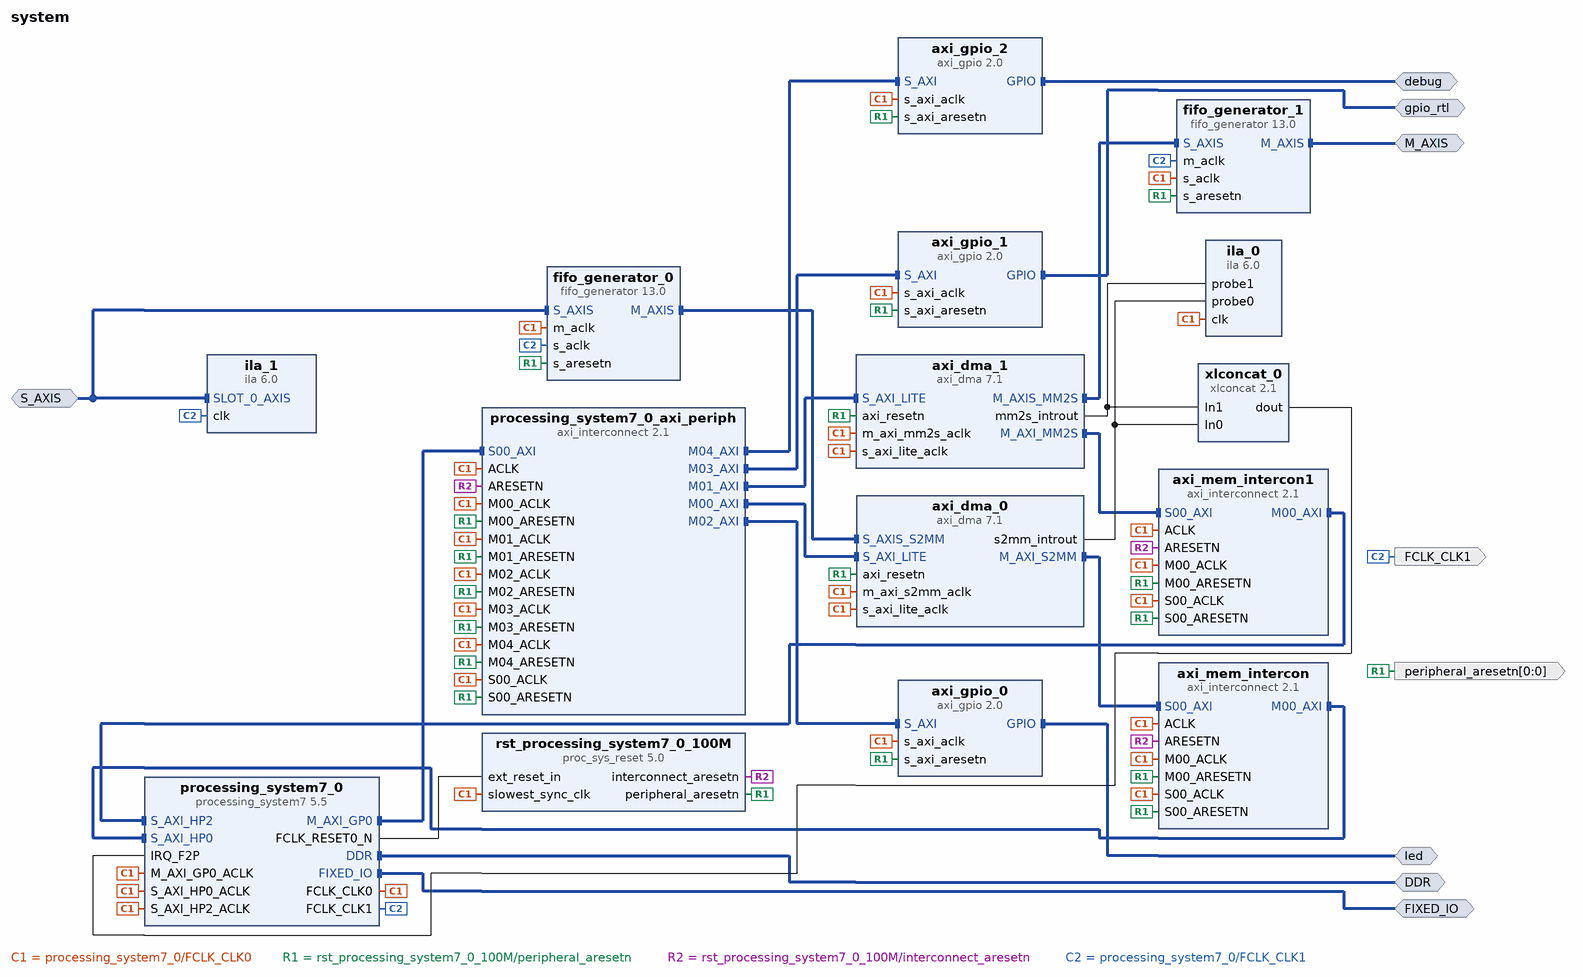
[diagram p0: block diagram of the top level]
# Vivado block design system, Vivado 2015.4
create_bd_design system

create_bd_intf_port -mode Master -vlnv xilinx.com:interface:ddrx_rtl:1.0 DDR
create_bd_intf_port -mode Master -vlnv xilinx.com:display_processing_system7:fixedio_rtl:1.0 FIXED_IO
create_bd_intf_port -mode Master -vlnv xilinx.com:interface:gpio_rtl:1.0 led
create_bd_intf_port -mode Slave -vlnv xilinx.com:interface:axis_rtl:1.0 S_AXIS
set_property -dict [list \
  CONFIG.TDATA_NUM_BYTES 4 \
  CONFIG.TDEST_WIDTH 0 \
  CONFIG.TID_WIDTH 0 \
  CONFIG.TUSER_WIDTH 0 \
  CONFIG.HAS_TREADY 1 \
  CONFIG.HAS_TSTRB 0 \
  CONFIG.HAS_TKEEP 1 \
  CONFIG.HAS_TLAST 1 \
  CONFIG.PHASE 0.000 \
  CONFIG.LAYERED_METADATA undef \
] [get_bd_intf_ports S_AXIS]
create_bd_intf_port -mode Master -vlnv xilinx.com:interface:axis_rtl:1.0 M_AXIS
create_bd_intf_port -mode Master -vlnv xilinx.com:interface:gpio_rtl:1.0 gpio_rtl
create_bd_intf_port -mode Master -vlnv xilinx.com:interface:gpio_rtl:1.0 debug
create_bd_port -dir O -from 0 -to 0 peripheral_aresetn
create_bd_port -dir O -type clk FCLK_CLK1
set_property -dict {CONFIG.ASSOCIATED_BUSIF S_AXIS:M_AXIS} [get_bd_ports FCLK_CLK1]

create_bd_cell -type ip -vlnv xilinx.com:ip:processing_system7:5.5 processing_system7_0
set_property -dict [list \
  CONFIG.PCW_FPGA0_PERIPHERAL_FREQMHZ 100 \
  CONFIG.PCW_FPGA1_PERIPHERAL_FREQMHZ 87 \
  CONFIG.PCW_FPGA2_PERIPHERAL_FREQMHZ 100 \
  CONFIG.PCW_USE_S_AXI_HP0 1 \
  CONFIG.PCW_USE_S_AXI_HP2 1 \
  CONFIG.PCW_USE_FABRIC_INTERRUPT 1 \
  CONFIG.PCW_EN_CLK1_PORT 1 \
  CONFIG.PCW_IRQ_F2P_INTR 1 \
  CONFIG.PCW_PRESET_BANK1_VOLTAGE {LVCMOS 1.8V} \
  CONFIG.PCW_UIPARAM_DDR_PARTNO {MT41K256M16 RE-125} \
  CONFIG.PCW_UART1_PERIPHERAL_ENABLE 1 \
] [get_bd_cells processing_system7_0]
# 2 more settings of processing_system7_0 are not shown: defaults, MIO pin electricals, DDR timing, and values the tool derives
create_bd_cell -type ip -vlnv xilinx.com:ip:axi_dma:7.1 axi_dma_0
set_property -dict {CONFIG.c_include_sg 0 CONFIG.c_sg_length_width 23 CONFIG.c_include_mm2s 0} [get_bd_cells axi_dma_0]
create_bd_cell -type ip -vlnv xilinx.com:ip:fifo_generator:13.0 fifo_generator_0
set_property -dict [list \
  CONFIG.Fifo_Implementation Independent_Clocks_Block_RAM \
  CONFIG.INTERFACE_TYPE AXI_STREAM \
  CONFIG.Performance_Options First_Word_Fall_Through \
  CONFIG.Reset_Pin false \
  CONFIG.Read_Data_Count true \
  CONFIG.Read_Data_Count_Width 9 \
  CONFIG.Clock_Type_AXI Independent_Clock \
  CONFIG.TDATA_NUM_BYTES 4 \
  CONFIG.TUSER_WIDTH 0 \
  CONFIG.Enable_TLAST true \
  CONFIG.HAS_TKEEP true \
  CONFIG.FIFO_Implementation_wach Independent_Clocks_Distributed_RAM \
  CONFIG.FIFO_Implementation_wdch Independent_Clocks_Block_RAM \
  CONFIG.FIFO_Implementation_wrch Independent_Clocks_Distributed_RAM \
  CONFIG.FIFO_Implementation_rach Independent_Clocks_Distributed_RAM \
  CONFIG.FIFO_Implementation_rdch Independent_Clocks_Block_RAM \
  CONFIG.FIFO_Implementation_axis Independent_Clocks_Block_RAM \
] [get_bd_cells fifo_generator_0]
create_bd_cell -type ip -vlnv xilinx.com:ip:xlconcat:2.1 xlconcat_0
create_bd_cell -type ip -vlnv xilinx.com:ip:axi_dma:7.1 axi_dma_1
set_property -dict [list \
  CONFIG.c_include_sg 0 \
  CONFIG.c_sg_length_width 23 \
  CONFIG.c_m_axis_mm2s_tdata_width 32 \
  CONFIG.c_include_s2mm 0 \
] [get_bd_cells axi_dma_1]
create_bd_cell -type ip -vlnv xilinx.com:ip:fifo_generator:13.0 fifo_generator_1
set_property -dict [list \
  CONFIG.Fifo_Implementation Independent_Clocks_Block_RAM \
  CONFIG.INTERFACE_TYPE AXI_STREAM \
  CONFIG.Performance_Options First_Word_Fall_Through \
  CONFIG.Reset_Pin false \
  CONFIG.Read_Data_Count true \
  CONFIG.Read_Data_Count_Width 9 \
  CONFIG.Clock_Type_AXI Independent_Clock \
  CONFIG.TDATA_NUM_BYTES 4 \
  CONFIG.TUSER_WIDTH 0 \
  CONFIG.Enable_TLAST true \
  CONFIG.HAS_TKEEP true \
  CONFIG.FIFO_Implementation_wach Independent_Clocks_Distributed_RAM \
  CONFIG.FIFO_Implementation_wdch Independent_Clocks_Block_RAM \
  CONFIG.FIFO_Implementation_wrch Independent_Clocks_Distributed_RAM \
  CONFIG.FIFO_Implementation_rach Independent_Clocks_Distributed_RAM \
  CONFIG.FIFO_Implementation_rdch Independent_Clocks_Block_RAM \
  CONFIG.FIFO_Implementation_axis Independent_Clocks_Block_RAM \
] [get_bd_cells fifo_generator_1]
create_bd_cell -type ip -vlnv xilinx.com:ip:axi_interconnect:2.1 axi_mem_intercon
set_property -dict {CONFIG.NUM_SI 1 CONFIG.NUM_MI 1} [get_bd_cells axi_mem_intercon]
create_bd_cell -type ip -vlnv xilinx.com:ip:proc_sys_reset:5.0 rst_processing_system7_0_100M
create_bd_cell -type ip -vlnv xilinx.com:ip:axi_interconnect:2.1 processing_system7_0_axi_periph
set_property -dict {CONFIG.NUM_MI 5} [get_bd_cells processing_system7_0_axi_periph]
create_bd_cell -type ip -vlnv xilinx.com:ip:axi_gpio:2.0 axi_gpio_0
set_property -dict {CONFIG.C_GPIO_WIDTH 2 CONFIG.C_ALL_INPUTS 0 CONFIG.C_ALL_OUTPUTS 1} [get_bd_cells axi_gpio_0]
create_bd_cell -type ip -vlnv xilinx.com:ip:ila:6.0 ila_0
set_property -dict {CONFIG.C_NUM_OF_PROBES 2 CONFIG.C_ENABLE_ILA_AXI_MON false CONFIG.C_MONITOR_TYPE Native} [get_bd_cells ila_0]
create_bd_cell -type ip -vlnv xilinx.com:ip:axi_interconnect:2.1 axi_mem_intercon1
set_property -dict {CONFIG.NUM_SI 1 CONFIG.NUM_MI 1} [get_bd_cells axi_mem_intercon1]
create_bd_cell -type ip -vlnv xilinx.com:ip:axi_gpio:2.0 axi_gpio_1
set_property -dict {CONFIG.C_GPIO_WIDTH 1 CONFIG.C_ALL_OUTPUTS 1} [get_bd_cells axi_gpio_1]
create_bd_cell -type ip -vlnv xilinx.com:ip:ila:6.0 ila_1
set_property -dict {CONFIG.C_NUM_OF_PROBES 9 CONFIG.C_SLOT_0_AXI_PROTOCOL AXI4S} [get_bd_cells ila_1]
create_bd_cell -type ip -vlnv xilinx.com:ip:axi_gpio:2.0 axi_gpio_2
set_property -dict {CONFIG.C_GPIO_WIDTH 2 CONFIG.C_ALL_INPUTS 1} [get_bd_cells axi_gpio_2]

# ---- connections ----

connect_bd_intf_net [get_bd_intf_pins axi_dma_0/M_AXI_S2MM] [get_bd_intf_pins axi_mem_intercon/S00_AXI]
connect_bd_intf_net [get_bd_intf_pins axi_mem_intercon/M00_AXI] [get_bd_intf_pins processing_system7_0/S_AXI_HP0]
connect_bd_intf_net [get_bd_intf_pins processing_system7_0/M_AXI_GP0] [get_bd_intf_pins processing_system7_0_axi_periph/S00_AXI]
connect_bd_intf_net [get_bd_intf_pins processing_system7_0_axi_periph/M00_AXI] [get_bd_intf_pins axi_dma_0/S_AXI_LITE]
connect_bd_intf_net [get_bd_intf_pins processing_system7_0_axi_periph/M01_AXI] [get_bd_intf_pins axi_dma_1/S_AXI_LITE]
connect_bd_intf_net [get_bd_intf_pins fifo_generator_1/S_AXIS] [get_bd_intf_pins axi_dma_1/M_AXIS_MM2S]
connect_bd_intf_net [get_bd_intf_pins fifo_generator_0/M_AXIS] [get_bd_intf_pins axi_dma_0/S_AXIS_S2MM]
connect_bd_intf_net [get_bd_intf_pins processing_system7_0_axi_periph/M02_AXI] [get_bd_intf_pins axi_gpio_0/S_AXI]
connect_bd_intf_net [get_bd_intf_pins axi_mem_intercon1/M00_AXI] [get_bd_intf_pins processing_system7_0/S_AXI_HP2]
connect_bd_intf_net [get_bd_intf_pins axi_dma_1/M_AXI_MM2S] [get_bd_intf_pins axi_mem_intercon1/S00_AXI]
connect_bd_intf_net [get_bd_intf_pins processing_system7_0_axi_periph/M03_AXI] [get_bd_intf_pins axi_gpio_1/S_AXI]
connect_bd_intf_net [get_bd_intf_pins processing_system7_0_axi_periph/M04_AXI] [get_bd_intf_pins axi_gpio_2/S_AXI]
connect_bd_intf_net [get_bd_intf_ports DDR] [get_bd_intf_pins processing_system7_0/DDR]
connect_bd_intf_net [get_bd_intf_ports FIXED_IO] [get_bd_intf_pins processing_system7_0/FIXED_IO]
connect_bd_intf_net [get_bd_intf_ports led] [get_bd_intf_pins axi_gpio_0/GPIO]
connect_bd_intf_net [get_bd_intf_ports S_AXIS] [get_bd_intf_pins fifo_generator_0/S_AXIS]
connect_bd_intf_net [get_bd_intf_ports S_AXIS] [get_bd_intf_pins ila_1/SLOT_0_AXIS]
connect_bd_intf_net [get_bd_intf_ports M_AXIS] [get_bd_intf_pins fifo_generator_1/M_AXIS]
connect_bd_intf_net [get_bd_intf_ports gpio_rtl] [get_bd_intf_pins axi_gpio_1/GPIO]
connect_bd_intf_net [get_bd_intf_ports debug] [get_bd_intf_pins axi_gpio_2/GPIO]
connect_bd_net [get_bd_pins processing_system7_0/FCLK_CLK0] \
  [get_bd_pins axi_dma_0/m_axi_s2mm_aclk] [get_bd_pins rst_processing_system7_0_100M/slowest_sync_clk] \
  [get_bd_pins processing_system7_0/S_AXI_HP0_ACLK] [get_bd_pins processing_system7_0/M_AXI_GP0_ACLK] \
  [get_bd_pins axi_dma_0/s_axi_lite_aclk] [get_bd_pins axi_dma_1/s_axi_lite_aclk] [get_bd_pins axi_dma_1/m_axi_mm2s_aclk] \
  [get_bd_pins fifo_generator_1/s_aclk] [get_bd_pins fifo_generator_0/m_aclk] [get_bd_pins axi_gpio_0/s_axi_aclk] \
  [get_bd_pins ila_0/clk] [get_bd_pins processing_system7_0/S_AXI_HP2_ACLK] [get_bd_pins axi_gpio_1/s_axi_aclk] \
  [get_bd_pins axi_gpio_2/s_axi_aclk] [get_bd_pins axi_mem_intercon/S00_ACLK] [get_bd_pins axi_mem_intercon/ACLK] \
  [get_bd_pins axi_mem_intercon/M00_ACLK] [get_bd_pins processing_system7_0_axi_periph/S00_ACLK] \
  [get_bd_pins processing_system7_0_axi_periph/ACLK] [get_bd_pins processing_system7_0_axi_periph/M00_ACLK] \
  [get_bd_pins processing_system7_0_axi_periph/M01_ACLK] [get_bd_pins processing_system7_0_axi_periph/M02_ACLK] \
  [get_bd_pins processing_system7_0_axi_periph/M03_ACLK] [get_bd_pins axi_mem_intercon1/ACLK] \
  [get_bd_pins axi_mem_intercon1/S00_ACLK] [get_bd_pins axi_mem_intercon1/M00_ACLK] \
  [get_bd_pins processing_system7_0_axi_periph/M04_ACLK]
connect_bd_net [get_bd_pins processing_system7_0/FCLK_RESET0_N] [get_bd_pins rst_processing_system7_0_100M/ext_reset_in]
connect_bd_net [get_bd_pins rst_processing_system7_0_100M/peripheral_aresetn] \
  [get_bd_ports peripheral_aresetn] [get_bd_pins axi_dma_0/axi_resetn] [get_bd_pins axi_dma_1/axi_resetn] \
  [get_bd_pins fifo_generator_1/s_aresetn] [get_bd_pins axi_gpio_0/s_axi_aresetn] [get_bd_pins fifo_generator_0/s_aresetn] \
  [get_bd_pins axi_gpio_1/s_axi_aresetn] [get_bd_pins axi_gpio_2/s_axi_aresetn] [get_bd_pins axi_mem_intercon/S00_ARESETN] \
  [get_bd_pins axi_mem_intercon/M00_ARESETN] [get_bd_pins processing_system7_0_axi_periph/S00_ARESETN] \
  [get_bd_pins processing_system7_0_axi_periph/M00_ARESETN] [get_bd_pins processing_system7_0_axi_periph/M01_ARESETN] \
  [get_bd_pins processing_system7_0_axi_periph/M02_ARESETN] [get_bd_pins processing_system7_0_axi_periph/M03_ARESETN] \
  [get_bd_pins axi_mem_intercon1/S00_ARESETN] [get_bd_pins axi_mem_intercon1/M00_ARESETN] \
  [get_bd_pins processing_system7_0_axi_periph/M04_ARESETN]
connect_bd_net [get_bd_pins rst_processing_system7_0_100M/interconnect_aresetn] \
  [get_bd_pins axi_mem_intercon/ARESETN] [get_bd_pins processing_system7_0_axi_periph/ARESETN] \
  [get_bd_pins axi_mem_intercon1/ARESETN]
connect_bd_net [get_bd_pins axi_dma_0/s2mm_introut] [get_bd_pins xlconcat_0/In0] [get_bd_pins ila_0/probe0]
connect_bd_net [get_bd_pins axi_dma_1/mm2s_introut] [get_bd_pins xlconcat_0/In1] [get_bd_pins ila_0/probe1]
connect_bd_net [get_bd_pins xlconcat_0/dout] [get_bd_pins processing_system7_0/IRQ_F2P]
connect_bd_net [get_bd_pins processing_system7_0/FCLK_CLK1] \
  [get_bd_ports FCLK_CLK1] [get_bd_pins fifo_generator_0/s_aclk] [get_bd_pins fifo_generator_1/m_aclk] \
  [get_bd_pins ila_1/clk]

# ---- address map ----
assign_bd_address -offset 0x00000000 -range 1G -target_address_space [get_bd_addr_spaces axi_dma_0/Data_S2MM] [get_bd_addr_segs processing_system7_0/S_AXI_HP0/HP0_DDR_LOWOCM]
assign_bd_address -offset 0x00000000 -range 1G -target_address_space [get_bd_addr_spaces axi_dma_1/Data_MM2S] [get_bd_addr_segs processing_system7_0/S_AXI_HP2/HP2_DDR_LOWOCM]
assign_bd_address -offset 0x40400000 -range 64K -target_address_space [get_bd_addr_spaces processing_system7_0/Data] [get_bd_addr_segs axi_dma_0/S_AXI_LITE/Reg]
assign_bd_address -offset 0x40410000 -range 64K -target_address_space [get_bd_addr_spaces processing_system7_0/Data] [get_bd_addr_segs axi_dma_1/S_AXI_LITE/Reg]
assign_bd_address -offset 0x41200000 -range 64K -target_address_space [get_bd_addr_spaces processing_system7_0/Data] [get_bd_addr_segs axi_gpio_0/S_AXI/Reg]
assign_bd_address -offset 0x41210000 -range 64K -target_address_space [get_bd_addr_spaces processing_system7_0/Data] [get_bd_addr_segs axi_gpio_1/S_AXI/Reg]
assign_bd_address -offset 0x41220000 -range 64K -target_address_space [get_bd_addr_spaces processing_system7_0/Data] [get_bd_addr_segs axi_gpio_2/S_AXI/Reg]

validate_bd_design
save_bd_design
